# EAGLE design idetrol-singlelayer (EAGLE 5.11)
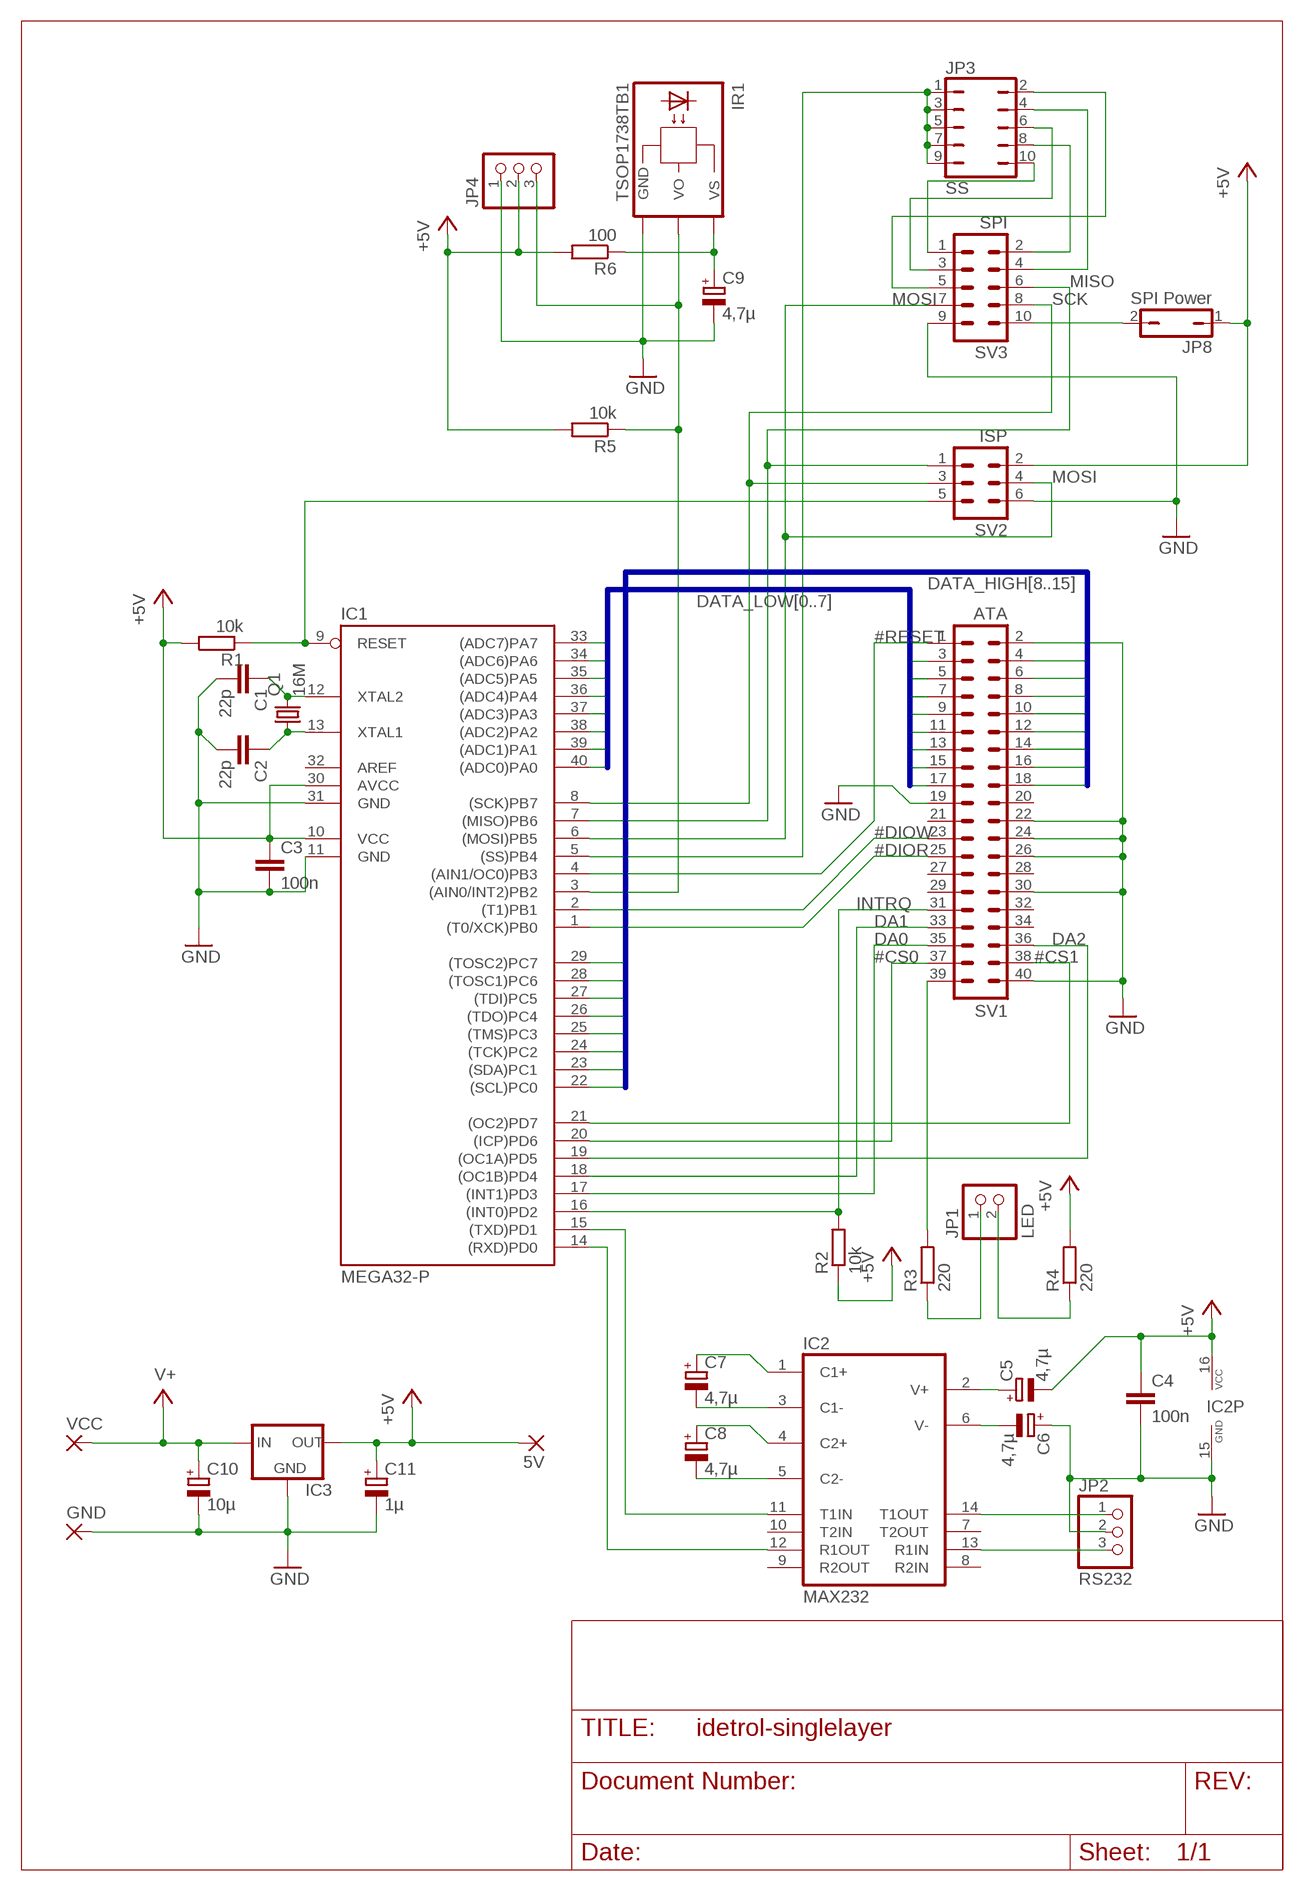
[diagram p0: schematic, sheet 1]

## Parts
5V  2,54/1,0  [2,54/1,0]
C1  22p  C-EU025-024X044  [C025-024X044]
C2  22p  C-EU025-024X044  [C025-024X044]
C3  100n  C2,5-3  [C2.5-3]
C4  100n  C2,5-3  [C2.5-3]
C5  4,7µ  CPOL-EUE2.5-6  [E2,5-6]
C6  4,7µ  CPOL-EUE2.5-6  [E2,5-6]
C7  4,7µ  CPOL-EUE2.5-6  [E2,5-6]
C8  4,7µ  CPOL-EUE2.5-6  [E2,5-6]
C9  4,7µ  CPOL-EUE2.5-6  [E2,5-6]
C10  10µ  CPOL-EUE2.5-6  [E2,5-6]
C11  1µ  CPOL-EUE2.5-6  [E2,5-6]
GND  2,54/1,0  [2,54/1,0]
IC1  MEGA32-P  [DIL40]
IC2  MAX232  [DIL16]
IC3  78XXS  [78XXS]
IR1  TSOP1738TB1  [TSOP17_TB1]
JP1  LED  PINHD-1X2  [1X02]
JP2  RS232  PINHD-1X3  [1X03]
JP3  SS  JP5Q  [JP5Q]
JP4  PINHD-1X3  [1X03]
JP8  SPI Power  JP1Q  [JP1]
Q1  16M  CRYSTALHC49U70  [HC49U70]
R1  10k  R-EU_0207/10  [0207/10]
R2  10k  R-EU_0207/10  [0207/10]
R3  220  R-EU_0204/2V  [0204V]
R4  220  R-EU_0204/2V  [0204V]
R5  10k  R-EU_0204/2V  [0204V]
R6  100  R-EU_0207/10  [0207/10]
SV1  ATA  ML40  [ML40]
SV2  ISP  ML6  [ML6]
SV3  SPI  ML10  [ML10]
VCC  2,54/1,0  [2,54/1,0]

## Nets
#CS0: IC1.20((ICP)PD6) SV1.37
#CS1: IC1.21((OC2)PD7) SV1.38
#DIOR: IC1.1((T0/XCK)PB0) SV1.25
#DIOW: IC1.2((T1)PB1) SV1.23
#RESET: IC1.4((AIN1/OC0)PB3) SV1.1
+5V: 5V.1(P) C3.1 C4.1 C5.- C11.+ IC1.10(VCC) IC1.30(AVCC) IC2.16(VCC) IC3.OUT JP4.2 JP8.1 R1.2 R2.1 R4.2 R5.2 R6.2 SV2.2
DA0: IC1.17((INT1)PD3) SV1.35
DA1: IC1.18((OC1B)PD4) SV1.33
DA2: IC1.19((OC1A)PD5) SV1.36
DATA_HIGH8: IC1.22((SCL)PC0) SV1.4
DATA_HIGH9: IC1.23((SDA)PC1) SV1.6
DATA_HIGH10: IC1.24((TCK)PC2) SV1.8
DATA_HIGH11: IC1.25((TMS)PC3) SV1.10
DATA_HIGH12: IC1.26((TDO)PC4) SV1.12
DATA_HIGH13: IC1.27((TDI)PC5) SV1.14
DATA_HIGH14: IC1.28((TOSC1)PC6) SV1.16
DATA_HIGH15: IC1.29((TOSC2)PC7) SV1.18
DATA_LOW0: IC1.40((ADC0)PA0) SV1.17
DATA_LOW1: IC1.39((ADC1)PA1) SV1.15
DATA_LOW2: IC1.38((ADC2)PA2) SV1.13
DATA_LOW3: IC1.37((ADC3)PA3) SV1.11
DATA_LOW4: IC1.36((ADC4)PA4) SV1.9
DATA_LOW5: IC1.35((ADC5)PA5) SV1.7
DATA_LOW6: IC1.34((ADC6)PA6) SV1.5
DATA_LOW7: IC1.33((ADC7)PA7) SV1.3
GND: C1.2 C2.2 C3.2 C4.2 C6.+ C9.- C10.- C11.- GND.1(P) IC1.11(GND) IC1.31(GND) IC2.15(GND) IC3.GND IR1.GND JP2.2 JP4.1 SV1.2 SV1.19 SV1.22 SV1.24 SV1.26 SV1.30 SV1.40 SV2.6 SV3.9
INTRQ: IC1.16((INT0)PD2) R2.2 SV1.31
MISO: IC1.7((MISO)PB6) SV2.1 SV3.6
MOSI: IC1.6((MOSI)PB5) SV2.4 SV3.7
N$1: C1.1 IC1.12(XTAL2) Q1.2
N$2: C2.1 IC1.13(XTAL1) Q1.1
N$3: IC1.9(RESET) R1.1 SV2.5
N$4: C5.+ IC2.2(V+)
N$5: R3.2 SV1.39
N$6: JP1.2 R4.1
N$7: JP1.1 R3.1
N$8: C6.- IC2.6(V-)
N$9: C7.- IC2.3(C1-)
N$10: C7.+ IC2.1(C1+)
N$11: C8.- IC2.5(C2-)
N$12: C8.+ IC2.4(C2+)
N$13: IC1.14((RXD)PD0) IC2.12(R1OUT)
N$14: IC1.15((TXD)PD1) IC2.11(T1IN)
N$16: IC2.14(T1OUT) JP2.1
N$17: IC2.13(R1IN) JP2.3
N$21: JP3.2 SV3.5
N$22: JP3.4 SV3.4
N$23: JP3.6 SV3.3
N$24: JP3.8 SV3.2
N$25: JP3.10 SV3.1
N$26: IC1.3((AIN0/INT2)PB2) IR1.VO JP4.3 R5.1
N$27: C9.+ IR1.VS R6.1
N$28: JP8.2 SV3.10
SCK: IC1.8((SCK)PB7) SV2.3 SV3.8
SS: IC1.5((SS)PB4) JP3.1 JP3.3 JP3.5 JP3.7 JP3.9
V+: C10.+ IC3.IN VCC.1(P)
Unconnected: IC1.32(AREF) IC2.7(T2OUT) IC2.8(R2IN) IC2.9(R2OUT) IC2.10(T2IN) SV1.20 SV1.21 SV1.27 SV1.28 SV1.29 SV1.32 SV1.34

## Buses
DATA_LOW[0..7]
DATA_HIGH[8..15]

## Library data of the parts
5V GND VCC = wirepad:2,54/1,0: THROUGH-HOLE PAD
C1 C2 = rcl:C-EU: CAPACITOR, European symbol
C3 C4 = capacitor-wima:C: CAPACITOR naming: grid - package width
C5-C11 = rcl:CPOL-EU: POLARIZED CAPACITOR, European symbol
IC1 = atmel:MEGA32-P: MICROCONTROLLER 32 Kbytes FLASH 2 Kbytes SRAM 1 Kbytes EEPROM USART 8-channel 10 bit ADC Source: www.atmel.com .. doc2503.pdf
IC2 = maxim:MAX232: RS232 TRANSEIVER
IC3 = v-reg:78XXS: VOLTAGE REGULATOR
IR1 = telefunken:TSOP17*TB1: TSOP17..TB1 IR Receiver Modules for Remote Control Systems Source: http://www.vishay.com/docs/82042/82042.pdf
JP1 = pinhead:PINHD-1X2: PIN HEADER
JP2 JP4 = pinhead:PINHD-1X3: PIN HEADER
JP3 = jumper:JP5Q: JUMPER
JP8 = jumper:JP1Q: JUMPER
Q1 = crystal:CRYSTAL: CRYSTAL
R1-R6 = rcl:R-EU_: RESISTOR, European symbol
SV1 = con-harting-ml:ML40: HARTING
SV2 = con-ml:ML6: HARTING
SV3 = con-ml:ML10: HARTING

## Board
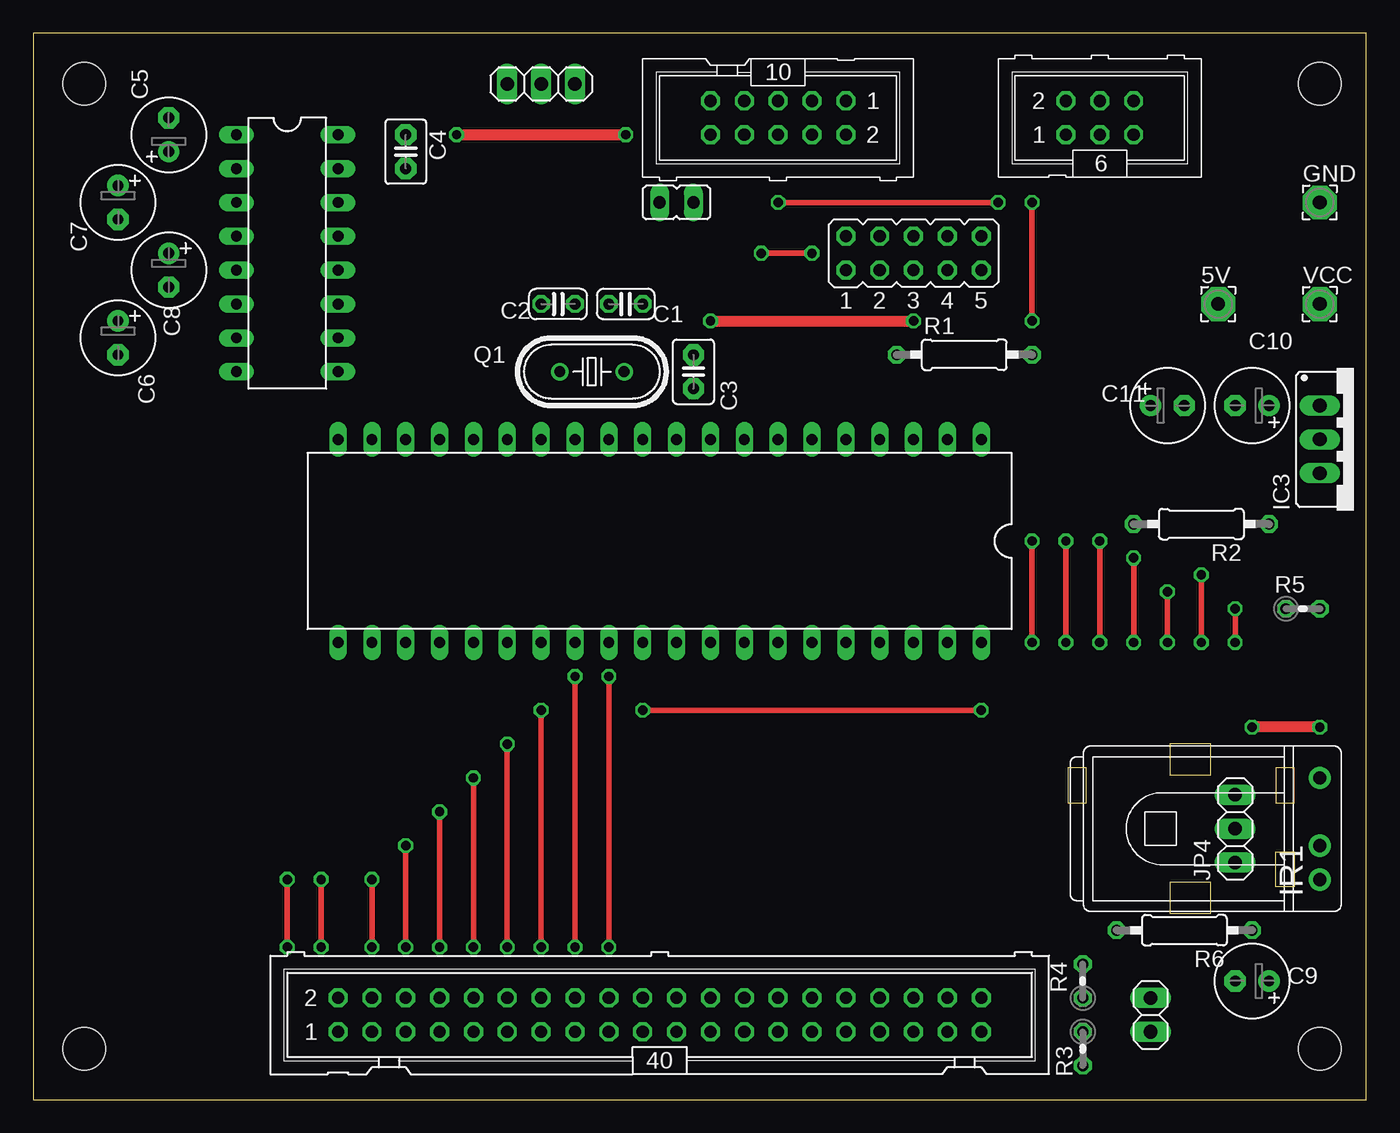
[diagram p1: board, top side]
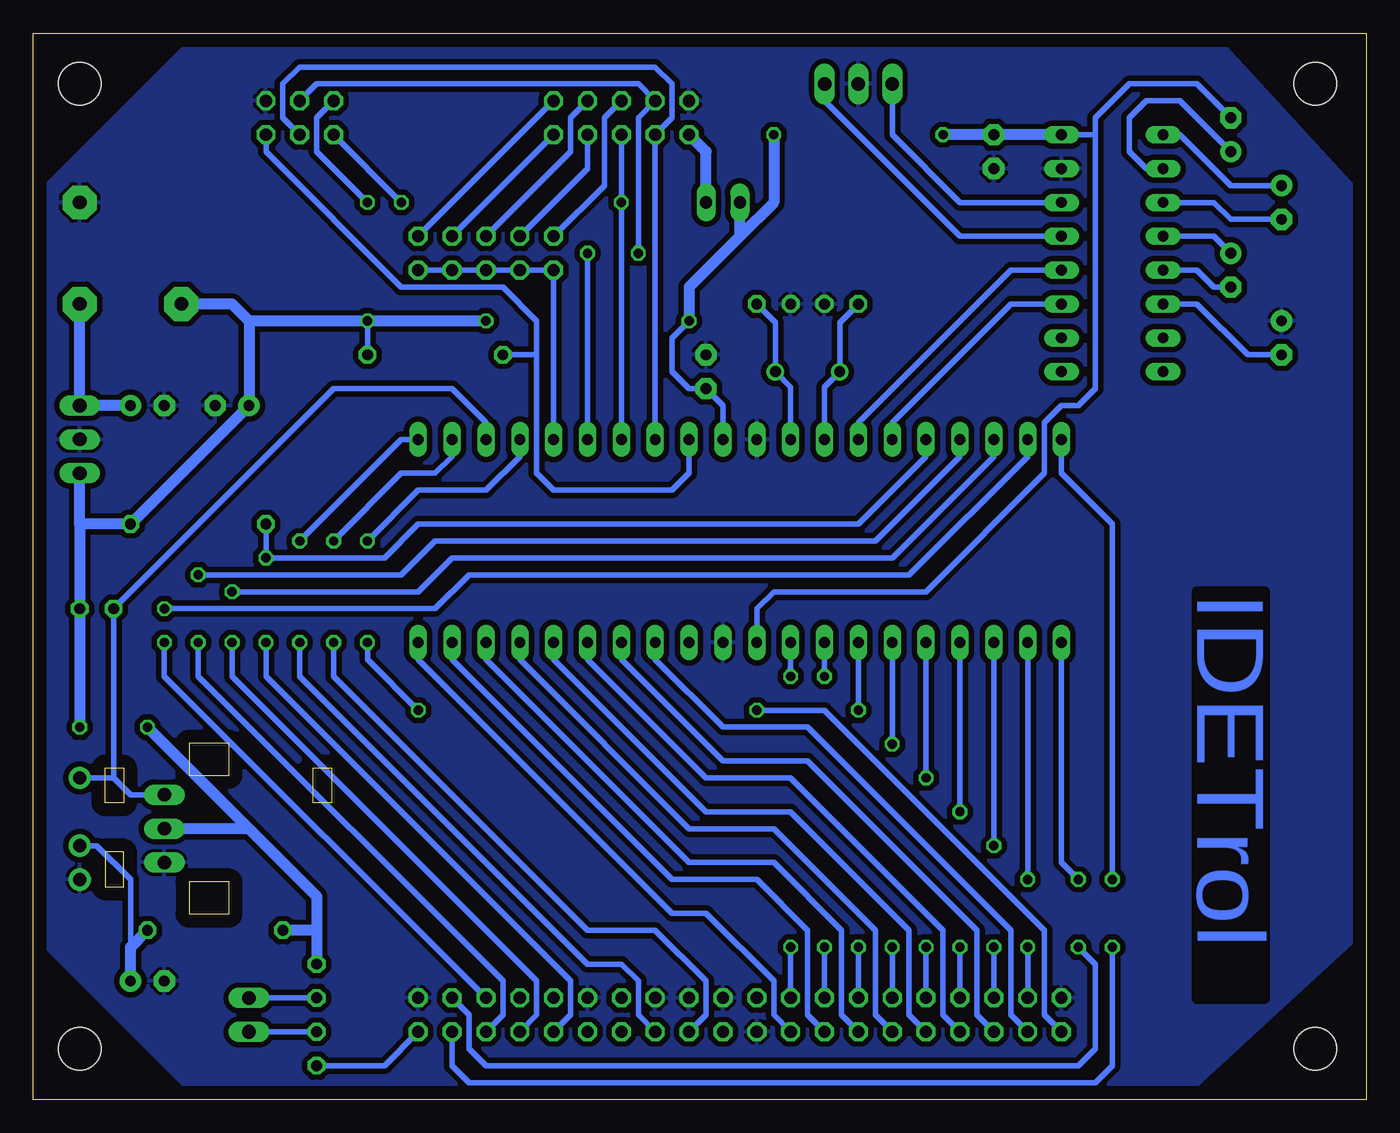
[diagram p2: board, bottom side, seen from below]

Size 100 x 80 mm. Coordinates in mm from the lower left corner, seen from the top.
Outline: 0,0 100,0 100,80 0,80 0,0
Copper layers (1*16): Top 0.035mm / dielectric 1.5mm / Bottom 0.035mm
Design rules "default *": minimum track width 8mil, minimum drill 24mil, track to track 8mil, track to pad 8mil, pad to pad 8mil, via to via 8mil, smd to smd 8mil, copper to edge 40mil, drill to drill 8mil, minimum pad ring 10mil, minimum via ring 8mil, stop-mask expansion 4mil, vias tented up to drill 0mil, thermal gap 10mil
Holes 3.2 mm at 3.81,76.2 96.52,76.2 96.52,3.81 3.81,3.81

### Footprints (pad centres in the part's own frame; a part is rotated, then mirrored left to right if it is on the bottom)
2,54/1,0 = drill 1.016 pad 2.54 octagon: 1 0,0
C025-024X044 = drill 0.813 octagon: 1 -1.27,0; 2 1.27,0
C2.5-3 = drill 0.813 pad 1.6 octagon: 1 -1.27,0; 2 1.27,0
E2,5-6 = drill 0.813 pad 1.6 round: + -1.27,0 | drill 0.813 pad 1.6 octagon: - 1.27,0
DIL40 = drill 0.813 long: 1 -24.13,-7.62; 2 -21.59,-7.62; 3 -19.05,-7.62; 4 -16.51,-7.62; 5 -13.97,-7.62; 6 -11.43,-7.62; 7 -8.89,-7.62; 8 -6.35,-7.62; 9 -3.81,-7.62; 10 -1.27,-7.62; 11 1.27,-7.62; 12 3.81,-7.62; 13 6.35,-7.62; 14 8.89,-7.62; 15 11.43,-7.62; 16 13.97,-7.62; 17 16.51,-7.62; 18 19.05,-7.62; 19 21.59,-7.62; 20 24.13,-7.62; 21 24.13,7.62; 22 21.59,7.62; 23 19.05,7.62; 24 16.51,7.62; 25 13.97,7.62; 26 11.43,7.62; 27 8.89,7.62; 28 6.35,7.62; 29 3.81,7.62; 30 1.27,7.62; 31 -1.27,7.62; 32 -3.81,7.62; 33 -6.35,7.62; 34 -8.89,7.62; 35 -11.43,7.62; 36 -13.97,7.62; 37 -16.51,7.62; 38 -19.05,7.62; 39 -21.59,7.62; 40 -24.13,7.62
DIL16 = drill 0.813 long: 1 -8.89,-3.81; 2 -6.35,-3.81; 3 -3.81,-3.81; 4 -1.27,-3.81; 5 1.27,-3.81; 6 3.81,-3.81; 7 6.35,-3.81; 8 8.89,-3.81; 9 8.89,3.81; 10 6.35,3.81; 11 3.81,3.81; 12 1.27,3.81; 13 -1.27,3.81; 14 -3.81,3.81; 15 -6.35,3.81; 16 -8.89,3.81
78XXS = drill 1.016 long: GND 0,-2.54; IN -2.54,-2.54; OUT 2.54,-2.54
TSOP17_TB1 = drill 1 pad 1.676 round: GND 0,-3.81; VO 0,3.81; VS 0,-1.27
1X02 = drill 1.016 long: 1 -1.27,0; 2 1.27,0
1X03 = drill 1.016 long: 1 -2.54,0; 2 0,0; 3 2.54,0
JP5Q = drill 0.914 octagon: 1 -5.08,-1.27; 2 -5.08,1.27; 3 -2.54,-1.27; 4 -2.54,1.27; 5 0,-1.27; 6 0,1.27; 7 2.54,-1.27; 8 2.54,1.27; 9 5.08,-1.27; 10 5.08,1.27
JP1 = drill 0.914 long: 1 0,-1.27; 2 0,1.27
HC49U70 = drill 0.813 round: 1 -2.413,0; 2 2.413,0
0207/10 = drill 0.813 octagon: 1 -5.08,0; 2 5.08,0
0204V = drill 0.813 octagon: 1 -1.27,0; 2 1.27,0
ML40 = drill 0.914 octagon: 1 -24.13,-1.27; 2 -24.13,1.27; 3 -21.59,-1.27; 4 -21.59,1.27; 5 -19.05,-1.27; 6 -19.05,1.27; 7 -16.51,-1.27; 8 -16.51,1.27; 9 -13.97,-1.27; 10 -13.97,1.27; 11 -11.43,-1.27; 12 -11.43,1.27; 13 -8.89,-1.27; 14 -8.89,1.27; 15 -6.35,-1.27; 16 -6.35,1.27; 17 -3.81,-1.27; 18 -3.81,1.27; 19 -1.27,-1.27; 20 -1.27,1.27; 21 1.27,-1.27; 22 1.27,1.27; 23 3.81,-1.27; 24 3.81,1.27; 25 6.35,-1.27; 26 6.35,1.27; 27 8.89,-1.27; 28 8.89,1.27; 29 11.43,-1.27; 30 11.43,1.27; 31 13.97,-1.27; 32 13.97,1.27; 33 16.51,-1.27; 34 16.51,1.27; 35 19.05,-1.27; 36 19.05,1.27; 37 21.59,-1.27; 38 21.59,1.27; 39 24.13,-1.27; 40 24.13,1.27
ML6 = drill 0.914 octagon: 1 -2.54,-1.27; 2 -2.54,1.27; 3 0,-1.27; 4 0,1.27; 5 2.54,-1.27; 6 2.54,1.27
ML10 = drill 0.914 octagon: 1 -5.08,-1.27; 2 -5.08,1.27; 3 -2.54,-1.27; 4 -2.54,1.27; 5 0,-1.27; 6 0,1.27; 7 2.54,-1.27; 8 2.54,1.27; 9 5.08,-1.27; 10 5.08,1.27

### Placement (x,y rotation side)
5V  88.9,59.69 0 top
C1  44.45,59.69 180 top
C2  39.37,59.69 0 top
C3  49.53,54.61 90 top
C4  27.94,71.12 270 top
C5  10.16,72.39 90 top
C6  6.35,57.15 270 top
C7  6.35,67.31 270 top
C8  10.16,62.23 270 top
C9  91.44,8.89 180 top
C10  91.44,52.07 180 top
C11  85.09,52.07 0 top
GND  96.52,67.31 0 top
IC1  46.99,41.91 180 top
IC2  19.05,63.5 270 top
IC3  99.06,49.53 270 top
IR1  96.52,20.32 0 top
JP1  83.82,6.35 90 top
JP2  38.1,76.2 0 top
JP3  66.04,63.5 0 top
JP4  90.17,20.32 90 top
JP8  48.26,67.31 270 top
Q1  41.91,54.61 0 top
R1  69.85,55.88 0 top
R2  87.63,43.18 180 top
R3  78.74,3.81 270 top
R4  78.74,8.89 90 top
R5  95.25,36.83 0 top
R6  86.36,12.7 180 top
SV1  46.99,6.35 0 top
SV2  80.01,73.66 0 top
SV3  55.88,73.66 180 top
VCC  96.52,59.69 0 top

### Tracks (layer width: path | path; a pad name or v marks a point on that pad's centre or on a via)
#CS0  (via drill 0.7)
  Top 0.406: v19.05,11.43 v19.05,16.51
  Bottom 0.406: IC1.20 22.86,46.99 19.05,43.18 v19.05,16.51 | SV1.37 68.58,2.54 67.31,1.27 20.32,1.27 19.05,2.54 v19.05,11.43
#CS1  (via drill 0.7)
  Top 0.406: v21.59,11.43 v21.59,16.51
  Bottom 0.406: SV1.38 67.31,6.35 67.31,3.81 66.04,2.54 21.59,2.54 20.32,3.81 20.32,10.16 v21.59,11.43 | v21.59,16.51 22.86,17.78 IC1.21
#DIOR  (via drill 0.7)
  Top 0.406: v80.01,34.29 v80.01,41.91
  Bottom 0.406: SV1.25 54.61,6.35 54.61,8.89 55.88,10.16 58.42,10.16 80.01,31.75 v80.01,34.29 | v80.01,41.91 72.39,49.53 IC1.1
#DIOW  (via drill 0.7)
  Top 0.406: v77.47,34.29 v77.47,41.91
  Bottom 0.406: SV1.23 49.53,6.35 49.53,8.89 53.34,12.7 58.42,12.7 77.47,31.75 v77.47,34.29 | IC1.2 68.58,48.26 69.85,46.99 72.39,46.99 v77.47,41.91
#RESET  (via drill 0.7)
  Top 0.406: v74.93,34.29 v74.93,41.91 | v45.72,29.21 v71.12,29.21
  Bottom 0.406: IC1.4 63.5,48.26 66.04,45.72 71.12,45.72 v74.93,41.91 | v71.12,29.21 74.93,33.02 v74.93,34.29 | v45.72,29.21 40.64,29.21 24.13,12.7 24.13,6.35 SV1.1
+5V  (via drill 0.7)
  Top 0.406: v74.93,58.42 v74.93,67.31
  Top 0.813: v31.75,72.39 v44.45,72.39 | v50.8,58.42 v66.04,58.42 | v96.52,27.94 v91.44,27.94
  Bottom 0.406: 20.32,72.39 20.32,73.66 17.78,76.2 12.7,76.2 C5.- | 20.32,72.39 IC2.16 | IC1.10 48.26,52.07 C3.1 50.8,53.34 52.07,54.61 52.07,57.15 v50.8,58.42 | SV2.2 78.74,73.66 78.74,71.12 v74.93,67.31 | v74.93,58.42 R1.2 | 20.32,72.39 20.32,53.34 21.59,52.07 22.86,52.07 24.13,50.8 24.13,46.99 33.02,38.1 44.45,38.1 45.72,36.83 IC1.30
  Bottom 0.813: IC2.16 C4.1 v31.75,72.39 | v66.04,58.42 v74.93,58.42 83.82,58.42 | 96.52,43.18 R5.2 v96.52,27.94 | 96.52,43.18 IC3.OUT | 96.52,43.18 R2.1 C11.+ 83.82,58.42 | v50.8,58.42 50.8,60.96 46.99,64.77 | 46.99,64.77 44.45,67.31 v44.45,72.39 | 46.99,64.77 JP8.1 | v91.44,27.94 83.82,20.32 | 83.82,20.32 78.74,15.24 78.74,12.7 | 78.74,12.7 R6.2 | 78.74,12.7 R4.2 | 83.82,20.32 JP4.2 | 5V.1 85.09,59.69 83.82,58.42
DA0  (via drill 0.7)
  Top 0.406: v87.63,34.29 v87.63,39.37
  Bottom 0.406: SV1.35 64.77,6.35 64.77,8.89 87.63,31.75 v87.63,34.29 | IC1.17 30.48,48.26 36.83,41.91 69.85,41.91 72.39,39.37 v87.63,39.37
DA1  (via drill 0.7)
  Top 0.406: v85.09,34.29 v85.09,38.1
  Bottom 0.406: IC1.18 27.94,48.26 35.56,40.64 68.58,40.64 71.12,38.1 v85.09,38.1 | SV1.33 62.23,6.35 62.23,8.89 85.09,31.75 v85.09,34.29
DA2  (via drill 0.7)
  Top 0.406: v90.17,36.83 v90.17,34.29
  Bottom 0.406: IC1.19 25.4,48.26 34.29,39.37 67.31,39.37 69.85,36.83 v90.17,36.83 | v90.17,34.29 90.17,31.75 SV1.36
DATA_HIGH8  (via drill 0.7)
  Top 0.406: v25.4,11.43 v25.4,16.51
  Bottom 0.406: SV1.4 v25.4,11.43 | v25.4,16.51 IC1.22
DATA_HIGH9  (via drill 0.7)
  Top 0.406: v27.94,11.43 v27.94,19.05
  Bottom 0.406: SV1.6 v27.94,11.43 | v27.94,19.05 IC1.23
DATA_HIGH10  (via drill 0.7)
  Top 0.406: v30.48,11.43 v30.48,21.59
  Bottom 0.406: SV1.8 v30.48,11.43 | v30.48,21.59 IC1.24
DATA_HIGH11  (via drill 0.7)
  Top 0.406: v33.02,11.43 v33.02,24.13
  Bottom 0.406: SV1.10 v33.02,11.43 | v33.02,24.13 IC1.25
DATA_HIGH12  (via drill 0.7)
  Top 0.406: v35.56,11.43 v35.56,26.67
  Bottom 0.406: SV1.12 v35.56,11.43 | v35.56,26.67 IC1.26
DATA_HIGH13  (via drill 0.7)
  Top 0.406: v38.1,11.43 v38.1,29.21
  Bottom 0.406: SV1.14 v38.1,11.43 | v38.1,29.21 IC1.27
DATA_HIGH14  (via drill 0.7)
  Top 0.406: v40.64,11.43 v40.64,31.75
  Bottom 0.406: SV1.16 v40.64,11.43 | v40.64,31.75 IC1.28
DATA_HIGH15  (via drill 0.7)
  Top 0.406: v43.18,11.43 v43.18,31.75
  Bottom 0.406: SV1.18 v43.18,11.43 | v43.18,31.75 IC1.29
DATA_LOW0
  Bottom 0.406: SV1.17 44.45,6.35 44.45,8.89 49.53,13.97 52.07,13.97 71.12,33.02 IC1.40
DATA_LOW1
  Bottom 0.406: SV1.15 41.91,6.35 41.91,12.7 45.72,16.51 52.07,16.51 68.58,33.02 IC1.39
DATA_LOW2
  Bottom 0.406: SV1.13 39.37,6.35 39.37,12.7 44.45,17.78 50.8,17.78 66.04,33.02 IC1.38
DATA_LOW3
  Bottom 0.406: SV1.11 36.83,6.35 36.83,12.7 44.45,20.32 50.8,20.32 63.5,33.02 IC1.37
DATA_LOW4
  Bottom 0.406: SV1.9 34.29,6.35 34.29,12.7 43.18,21.59 49.53,21.59 60.96,33.02 IC1.36
DATA_LOW5
  Bottom 0.406: SV1.7 31.75,6.35 31.75,12.7 43.18,24.13 49.53,24.13 58.42,33.02 IC1.35
DATA_LOW6
  Bottom 0.406: SV1.5 29.21,6.35 29.21,12.7 41.91,25.4 48.26,25.4 55.88,33.02 IC1.34
DATA_LOW7
  Bottom 0.406: SV1.3 26.67,6.35 26.67,12.7 41.91,27.94 48.26,27.94 53.34,33.02 IC1.33
GND
  pour Bottom (isolate 0.406): 12.7,81.28 -1.27,66.04 -1.27,13.97 15.24,-1.27 86.36,-1.27 101.6,13.97 101.6,66.04 86.36,81.28
INTRQ  (via drill 0.7)
  Top 0.406: v82.55,34.29 v82.55,40.64
  Bottom 0.406: SV1.31 59.69,6.35 59.69,8.89 82.55,31.75 v82.55,34.29 | IC1.16 33.02,48.26 38.1,43.18 71.12,43.18 73.66,40.64 v82.55,40.64 R2.2
MISO  (via drill 0.7)
  Top 0.406: v55.88,67.31 v72.39,67.31
  Bottom 0.406: IC1.7 v55.88,67.31 SV3.6 | v72.39,67.31 SV2.1
MOSI  (via drill 0.7)
  Top 0.406: v58.42,63.5 v54.61,63.5
  Bottom 0.406: IC1.6 v58.42,63.5 | SV2.4 78.74,76.2 54.61,76.2 SV3.7 54.61,73.66 v54.61,63.5
N$1
  Bottom 0.406: IC1.12 43.18,53.47 Q1.2 44.32,58.29 C1.1
N$2
  Bottom 0.406: IC1.13 40.64,53.47 Q1.1 39.5,58.29 C2.1
N$3
  Bottom 0.406: SV2.5 82.55,71.12 72.39,60.96 64.77,60.96 62.23,58.42 62.23,55.88 | 62.23,55.88 62.23,46.99 60.96,45.72 52.07,45.72 50.8,46.99 IC1.9 | 62.23,55.88 R1.1
N$4
  Bottom 0.406: C5.+ 13.97,74.93 16.51,74.93 17.78,73.66 17.78,71.12 16.51,69.85 IC2.2
N$5
  Bottom 0.406: SV1.39 73.66,2.54 R3.2
N$6
  Bottom 0.406: R4.1 JP1.2
N$7
  Bottom 0.406: R3.1 JP1.1
N$8
  Bottom 0.406: IC2.6 12.7,59.69 8.89,55.88 C6.-
N$9
  Bottom 0.406: IC2.3 11.43,67.31 10.16,66.04 C7.-
N$10
  Bottom 0.406: IC2.1 13.97,72.39 10.16,68.58 C7.+
N$11
  Bottom 0.406: IC2.5 12.7,62.23 11.43,60.96 C8.-
N$12
  Bottom 0.406: IC2.4 11.43,64.77 C8.+
N$13
  Bottom 0.406: IC1.14 38.1,50.8 26.67,62.23 IC2.12
N$14
  Bottom 0.406: IC1.15 35.56,50.8 26.67,59.69 IC2.11
N$16
  Bottom 0.406: JP2.1 35.56,72.39 30.48,67.31 IC2.14
N$17
  Bottom 0.406: JP2.3 40.64,74.93 30.48,64.77 IC2.13
N$21
  Bottom 0.406: JP3.2 57.15,68.58 57.15,73.66 SV3.5
N$22
  Bottom 0.406: JP3.4 58.42,69.85 SV3.4
N$23
  Bottom 0.406: JP3.6 59.69,71.12 59.69,73.66 SV3.3
N$24
  Bottom 0.406: SV3.2 JP3.8
N$25
  Bottom 0.406: SV3.1 JP3.10
N$26
  Bottom 0.406: IC1.3 66.04,50.8 68.58,53.34 77.47,53.34 R5.1 93.98,24.13 | 93.98,24.13 92.71,22.86 JP4.3 | 93.98,24.13 IR1.VO
N$27
  Bottom 0.406: IR1.VS 95.25,19.05 92.71,16.51 92.71,11.43
  Bottom 0.813: C9.+ 92.71,11.43 R6.1
N$28
  Bottom 0.813: JP8.2 49.53,71.12 SV3.10
SCK
  Bottom 0.406: IC1.8 SV3.8 52.07,73.66 52.07,76.2 53.34,77.47 80.01,77.47 81.28,76.2 81.28,73.66 SV2.3
SS
  Bottom 0.406: JP3.9 JP3.7 JP3.5 JP3.3 JP3.1 IC1.5
V+
  Bottom 0.813: C10.+ IC3.IN VCC.1

### Text on the board
Bottom: IDETrol
tDocu: IDETrol